# Altium project DISPLAY_BOARD.PrjPCB
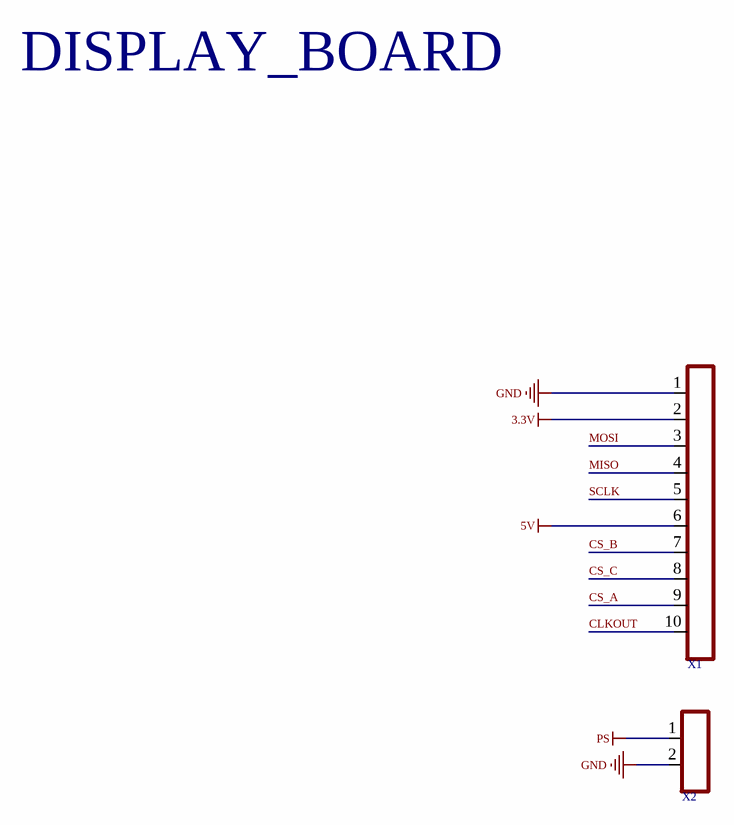
[diagram p0: DISPLAY_BOARD.SchDoc]
1 sheet, 2 parts. Net scope: global (net labels, ports and power ports of the same name join across sheets).
Board file: DISPLAY_BOARD.PcbDoc

## Sheet DISPLAY_BOARD.SchDoc
size A1

### Parts
X1  BH-10  [PBD-10]  (value not drawn)
X2  CONN-2-PIN  [CONN-PLS-2]  (value not drawn)

### Nets
3.3V: X1.2
5V: X1.6
GND: X1.1 X2.2
PS: X2.1
CLKOUT: X1.10
CS_A: X1.9
CS_B: X1.7
CS_C: X1.8
MISO: X1.4
MOSI: X1.3
SCLK: X1.5

### Notes on the sheet
- DISPLAY_BOARD